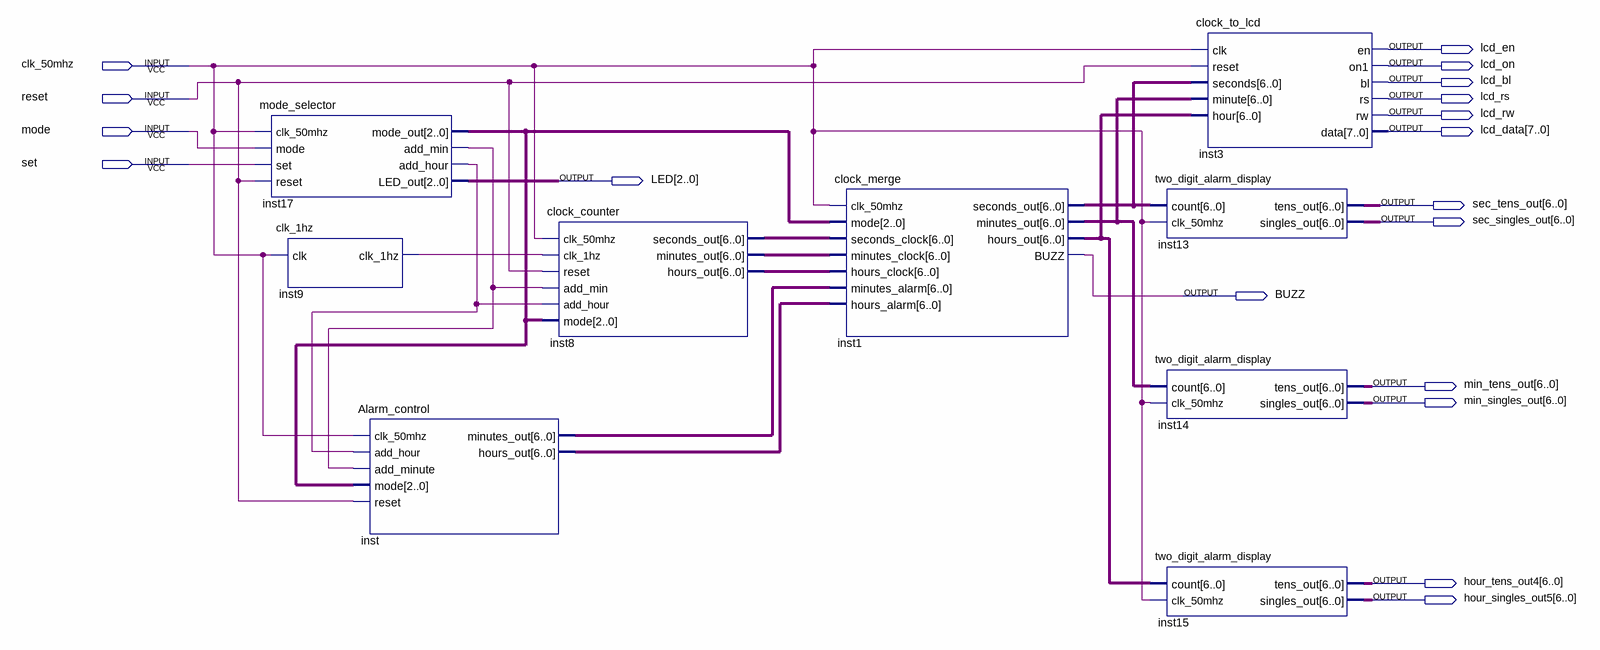
[diagram p0: schematic sheet]
// Quartus schematic BDF_alarm_clock2.bdf as structural Verilog: 9 symbols, 18 pins
module BDF_alarm_clock2 (
  input  clk_50mhz,
  input  reset,
  input  mode,
  input  set,
  output lcd_en,
  output lcd_on,
  output lcd_bl,
  output lcd_rs,
  output lcd_rw,
  output [7:0] lcd_data,
  output [2:0] LED,
  output [6:0] sec_tens_out,
  output [6:0] sec_singles_out,
  output BUZZ,
  output [6:0] min_tens_out,
  output [6:0] min_singles_out,
  output [6:0] hour_tens_out4,
  output [6:0] hour_singles_out5
);

  wire inst9_clk_1hz, inst17_add_hour, inst17_add_min;
  wire [2:0] inst17_mode_out;
  wire [6:0] inst1_hours_out, inst1_minutes_out, inst1_seconds_out, inst8_hours_out, inst8_minutes_out,
       inst8_seconds_out, inst_hours_out, inst_minutes_out;

  mode_selector inst17 (
    .clk_50mhz(clk_50mhz), .mode(mode), .set(set), .reset(reset), .mode_out(inst17_mode_out),
    .add_min(inst17_add_min), .add_hour(inst17_add_hour), .LED_out(LED));
  clk_1hz inst9 (.clk(clk_50mhz), .clk_1hz(inst9_clk_1hz));
  Alarm_control inst (
    .clk_50mhz(clk_50mhz), .add_hour(inst17_add_hour), .add_minute(inst17_add_min), .mode(inst17_mode_out),
    .reset(reset), .minutes_out(inst_minutes_out), .hours_out(inst_hours_out));
  clock_counter inst8 (
    .clk_50mhz(clk_50mhz), .clk_1hz(inst9_clk_1hz), .reset(reset), .add_min(inst17_add_min),
    .add_hour(inst17_add_hour), .mode(inst17_mode_out), .seconds_out(inst8_seconds_out),
    .minutes_out(inst8_minutes_out), .hours_out(inst8_hours_out));
  clock_merge inst1 (
    .clk_50mhz(clk_50mhz), .mode(inst17_mode_out), .seconds_clock(inst8_seconds_out),
    .minutes_clock(inst8_minutes_out), .hours_clock(inst8_hours_out), .minutes_alarm(inst_minutes_out),
    .hours_alarm(inst_hours_out), .seconds_out(inst1_seconds_out), .minutes_out(inst1_minutes_out),
    .hours_out(inst1_hours_out), .BUZZ(BUZZ));
  clock_to_lcd inst3 (
    .clk(clk_50mhz), .reset(reset), .seconds(inst1_seconds_out), .minute(inst1_minutes_out),
    .hour(inst1_hours_out), .en(lcd_en), .on1(lcd_on), .bl(lcd_bl), .rs(lcd_rs), .rw(lcd_rw), .data(lcd_data));
  two_digit_alarm_display inst13 (
    .count(inst1_seconds_out), .clk_50mhz(clk_50mhz), .tens_out(sec_tens_out), .singles_out(sec_singles_out));
  two_digit_alarm_display inst14 (
    .count(inst1_minutes_out), .clk_50mhz(clk_50mhz), .tens_out(min_tens_out), .singles_out(min_singles_out));
  two_digit_alarm_display inst15 (
    .count(inst1_hours_out), .clk_50mhz(clk_50mhz), .tens_out(hour_tens_out4), .singles_out(hour_singles_out5));
endmodule
